# EAGLE design SnapBIT-TRIO (EAGLE 7.3.0)
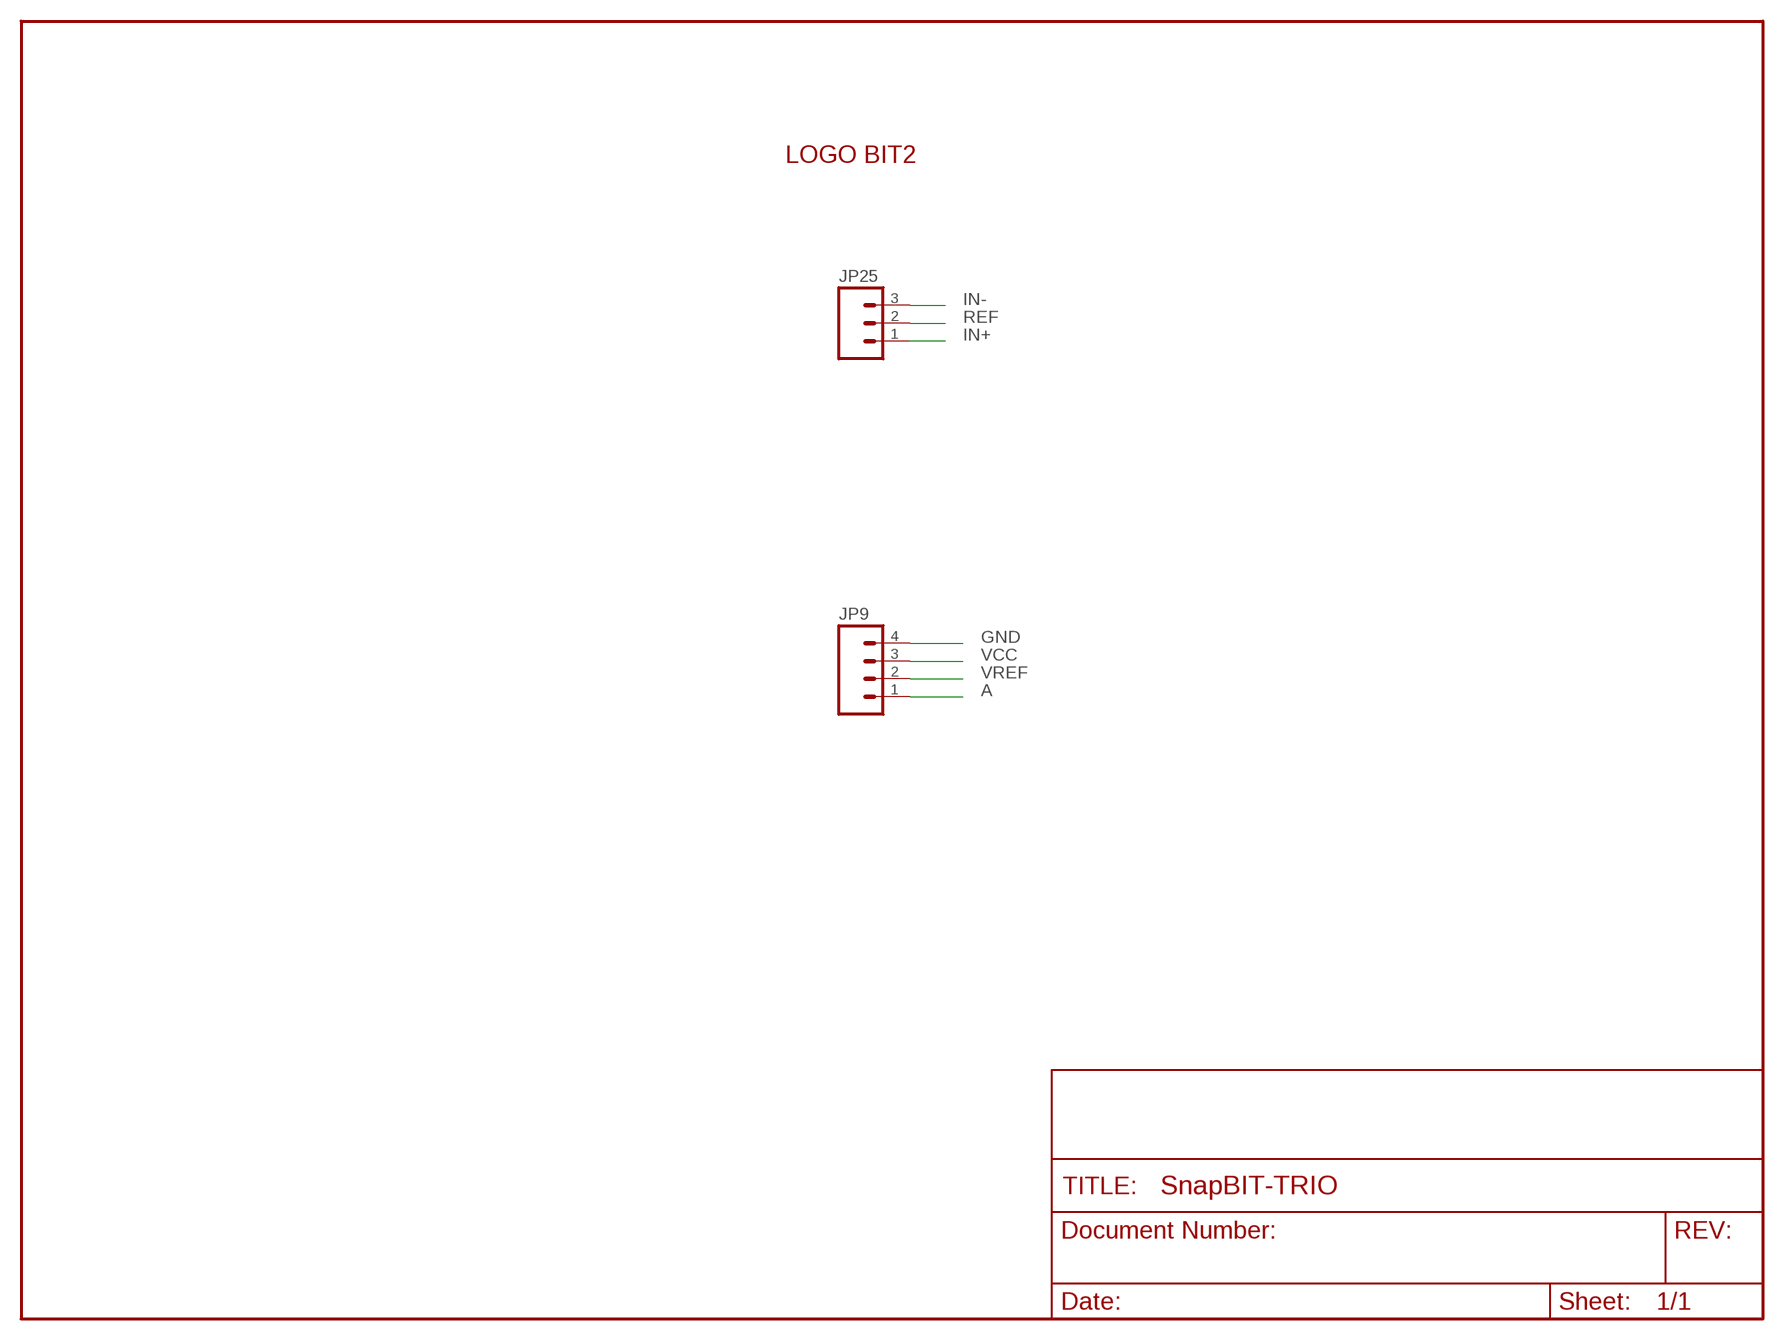
[diagram p0: schematic, sheet 1]

## Parts
JP9  M04JST-PTH  [JST-4-PTH]
JP25  M03JST-PTH  [JST-3-PTH]
U$1  LOGO_BIT2(4.72X3.78)  [LOGO_BIT2]

## Nets
A: JP9.1
GND: JP9.4
IN+: JP25.1
IN-: JP25.3
REF: JP25.2
VCC: JP9.3
VREF: JP9.2

## Library data of the parts
JP9 = SparkFun:M04: Header 4 Standard 4-pin 0.1" header. Use with straight break away headers (SKU : PRT-00116), right angle break away headers (PRT-00553), swiss pins (PRT-00743), machine pins (PRT-00117), and female headers (PRT-00115). Molex polarized connector foot print use with SKU : PRT-08231 with associated crimp pins and housings. 1MM SMD Version SKU: PRT-10208
JP25 = SparkFun:M03: Header 3 Standard 3-pin 0.1" header. Use with straight break away headers (SKU : PRT-00116), right angle break away headers (PRT-00553), swiss pins (PRT-00743), machine pins (PRT-00117), and female headers (PRT-00115). Molex polarized connector foot print use with SKU : PRT-08232 with associated crimp pins and housings.
U$1 = bit2_logo_27x8:LOGO_BIT2(4.72X3.78)

## Board
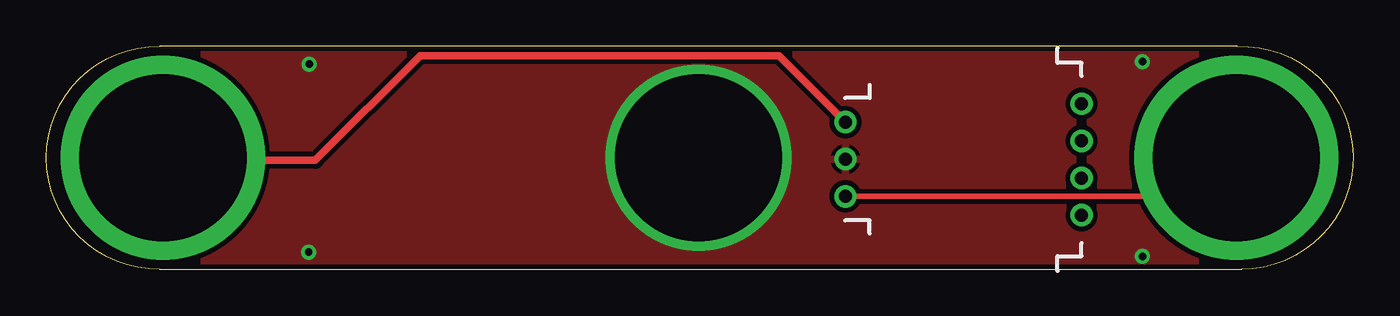
[diagram p1: board, top side]
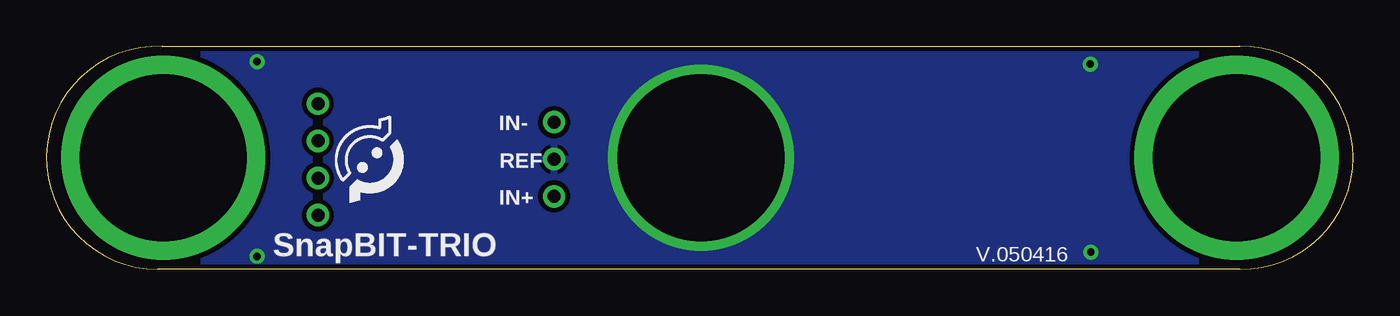
[diagram p2: board, bottom side, seen from below]

Size 70.41 x 12 mm. Coordinates in mm from the lower left corner, seen from the top.
Outline: 64.18,12 6.12,12 arc182 6.12,0 64.41,0 arc182 64.18,12
Copper layers (1*16): Top 0.035mm / dielectric 1mm / Bottom 0.035mm
Design rules "bitalino *": minimum track width 6mil, minimum drill 8mil, track to track 8mil, track to pad 8mil, pad to pad 8mil, via to via 8mil, smd to smd 8mil, copper to edge 2mil, drill to drill 8mil, minimum pad ring 10mil, minimum via ring 8mil, stop-mask expansion 6mil, vias tented up to drill 15mil, thermal gap 8mil

### Footprints (pad centres in the part's own frame; a part is rotated, then mirrored left to right if it is on the bottom)
JST-4-PTH = drill 0.7: 1 -3,-5; 2 -1,-5; 3 1,-5; 4 3,-5
JST-3-PTH = drill 0.7: 1 -2,-5; 2 0,-5; 3 2,-5

### Placement (x,y rotation side)
JP9  60.78,5.91 270 top
JP25  38.06,5.92 90 top
U$1  54.91,8.25 270 bottom

### Tracks (layer width: path | path; a pad name or v marks a point on that pad's centre or on a via)
IN+  (via drill 9 pad 11)
  Top 0.305: JP25.1 61.11,3.92
  Top 0.406: 61.11,3.92 62.04,3.92 v64.12,6
IN-  (via drill 9 pad 11)
  Top 0.406: JP25.3 43.06,7.96 43.01,7.96 39.46,11.51 20.13,11.51 14.49,5.87 6.41,5.87 v6.28,6
REF  (via drill 0.4, 9 pad 9.5)
  other vias: 35.13,6 14.17,11.05 14.13,0.92 59.06,0.69 59.06,11.18
  pour Top (isolate 0.254): 69.47,12.43 69.54,-0.13 2.08,-0.33 2.07,12.11
  pour Bottom (isolate 0.254): 69.34,12.46 69.37,-0.11 2,-0.29 2.22,12.01

### Text on the board
_bsilk: IN- | REF | IN+ | SnapBIT-TRIO | V.050416
Notes: (70,28X12)